# EAGLE schematic Schematic (EAGLE 9.7.0)
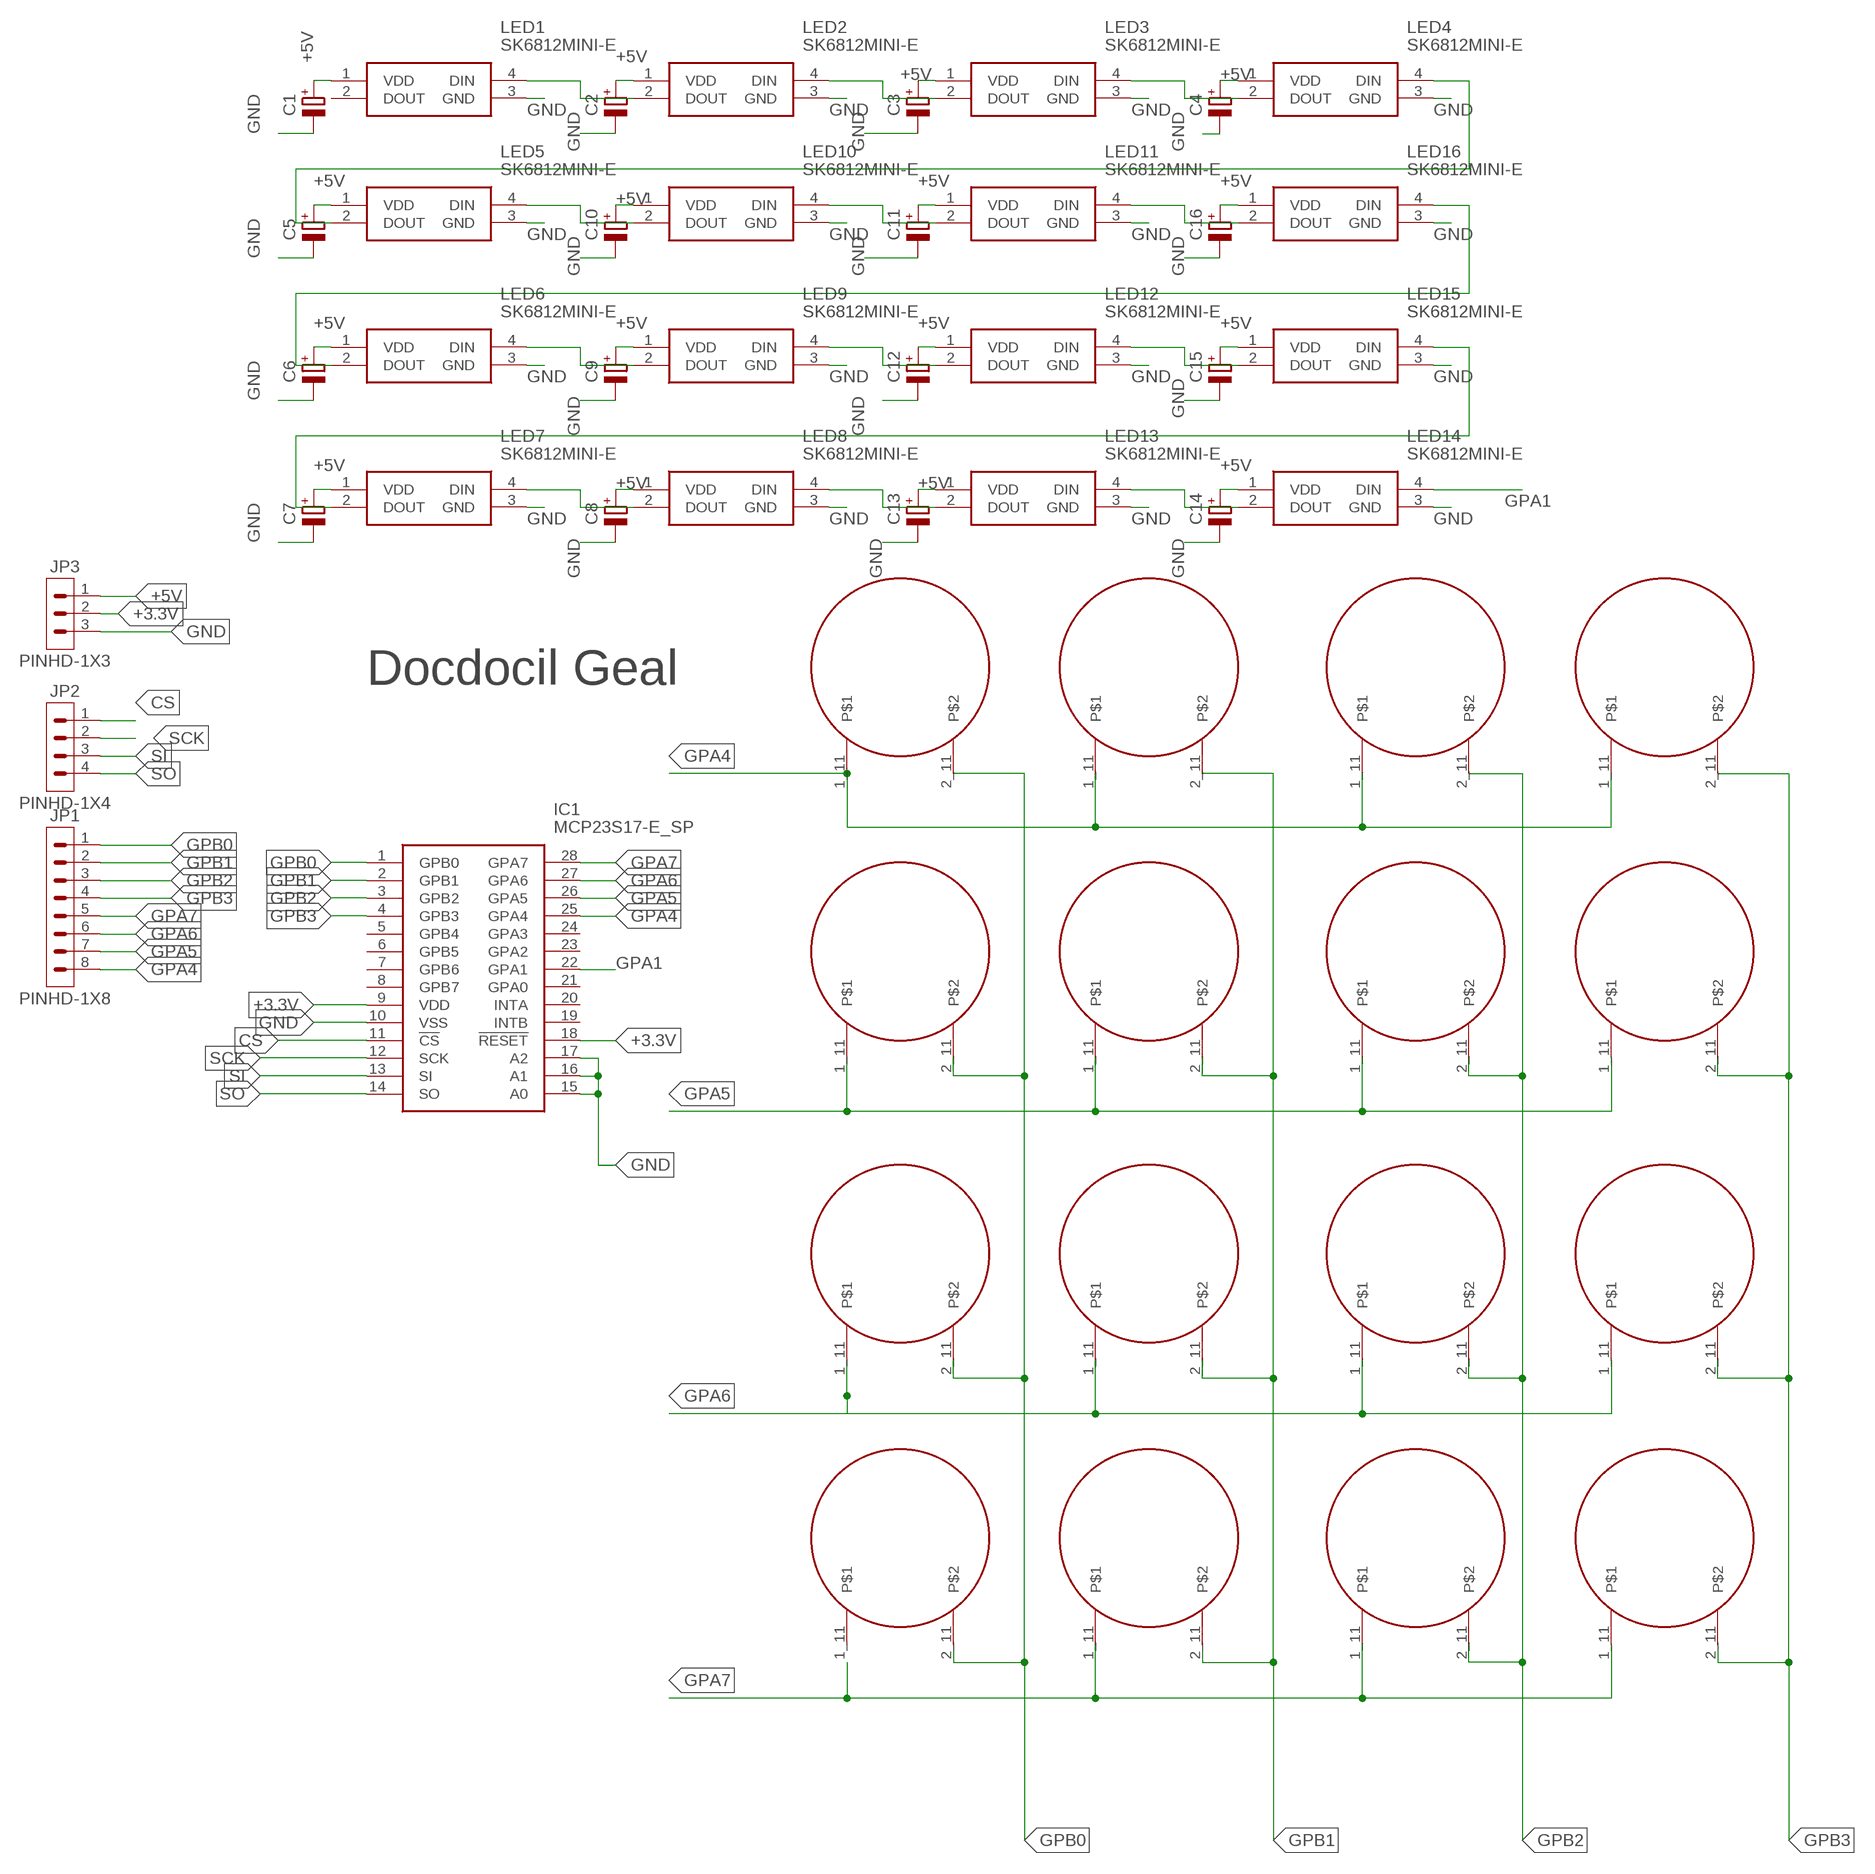
[diagram p0: schematic, sheet 1]

## Parts
C1  CAPACITOR-POLRADIAL-5MM-DIA  [CAPPRD254W65D500H1150B]
C2  CAPACITOR-POLRADIAL-5MM-DIA  [CAPPRD254W65D500H1150B]
C3  CAPACITOR-POLRADIAL-5MM-DIA  [CAPPRD254W65D500H1150B]
C4  CAPACITOR-POLRADIAL-5MM-DIA  [CAPPRD254W65D500H1150B]
C5  CAPACITOR-POLRADIAL-5MM-DIA  [CAPPRD254W65D500H1150B]
C6  CAPACITOR-POLRADIAL-5MM-DIA  [CAPPRD254W65D500H1150B]
C7  CAPACITOR-POLRADIAL-5MM-DIA  [CAPPRD254W65D500H1150B]
C8  CAPACITOR-POLRADIAL-5MM-DIA  [CAPPRD254W65D500H1150B]
C9  CAPACITOR-POLRADIAL-5MM-DIA  [CAPPRD254W65D500H1150B]
C10  CAPACITOR-POLRADIAL-5MM-DIA  [CAPPRD254W65D500H1150B]
C11  CAPACITOR-POLRADIAL-5MM-DIA  [CAPPRD254W65D500H1150B]
C12  CAPACITOR-POLRADIAL-5MM-DIA  [CAPPRD254W65D500H1150B]
C13  CAPACITOR-POLRADIAL-5MM-DIA  [CAPPRD254W65D500H1150B]
C14  CAPACITOR-POLRADIAL-5MM-DIA  [CAPPRD254W65D500H1150B]
C15  CAPACITOR-POLRADIAL-5MM-DIA  [CAPPRD254W65D500H1150B]
C16  CAPACITOR-POLRADIAL-5MM-DIA  [CAPPRD254W65D500H1150B]
IC1  MCP23S17-E_SP  [DIP794W56P254L3486H508Q28N]
JP1  PINHD-1X8  [1X08]
JP2  PINHD-1X4  [1X04]
JP3  PINHD-1X3  [1X03]
LED1  SK6812MINI-E  [SK6812MINIE]
LED2  SK6812MINI-E  [SK6812MINIE]
LED3  SK6812MINI-E  [SK6812MINIE]
LED4  SK6812MINI-E  [SK6812MINIE]
LED5  SK6812MINI-E  [SK6812MINIE]
LED6  SK6812MINI-E  [SK6812MINIE]
LED7  SK6812MINI-E  [SK6812MINIE]
LED8  SK6812MINI-E  [SK6812MINIE]
LED9  SK6812MINI-E  [SK6812MINIE]
LED10  SK6812MINI-E  [SK6812MINIE]
LED11  SK6812MINI-E  [SK6812MINIE]
LED12  SK6812MINI-E  [SK6812MINIE]
LED13  SK6812MINI-E  [SK6812MINIE]
LED14  SK6812MINI-E  [SK6812MINIE]
LED15  SK6812MINI-E  [SK6812MINIE]
LED16  SK6812MINI-E  [SK6812MINIE]
U$1  MIDI_B_RING  [RUBBER_RING_BUTTON]
U$2  MIDI_B_RING  [RUBBER_RING_BUTTON]
U$3  MIDI_B_RING  [RUBBER_RING_BUTTON]
U$4  MIDI_B_RING  [RUBBER_RING_BUTTON]
U$5  MIDI_B_RING  [RUBBER_RING_BUTTON]
U$6  MIDI_B_RING  [RUBBER_RING_BUTTON]
U$7  MIDI_B_RING  [RUBBER_RING_BUTTON]
U$8  MIDI_B_RING  [RUBBER_RING_BUTTON]
U$9  MIDI_B_RING  [RUBBER_RING_BUTTON]
U$10  MIDI_B_RING  [RUBBER_RING_BUTTON]
U$11  MIDI_B_RING  [RUBBER_RING_BUTTON]
U$12  MIDI_B_RING  [RUBBER_RING_BUTTON]
U$13  MIDI_B_RING  [RUBBER_RING_BUTTON]
U$14  MIDI_B_RING  [RUBBER_RING_BUTTON]
U$15  MIDI_B_RING  [RUBBER_RING_BUTTON]
U$16  MIDI_B_RING  [RUBBER_RING_BUTTON]

## Nets
+3.3V: IC1.9(VDD) IC1.18(!RESET) JP3.2
+5V: C1.1(+) C2.1(+) C3.1(+) C4.1(+) C5.1(+) C6.1(+) C7.1(+) C8.1(+) C9.1(+) C10.1(+) C11.1(+) C12.1(+) C13.1(+) C14.1(+) C15.1(+) C16.1(+) JP3.1 LED1.1(VDD) LED2.1(VDD) LED3.1(VDD) LED4.1(VDD) LED5.1(VDD) LED6.1(VDD) LED7.1(VDD) LED8.1(VDD) LED9.1(VDD) LED10.1(VDD) LED11.1(VDD) LED12.1(VDD) LED13.1(VDD) LED14.1(VDD) LED15.1(VDD) LED16.1(VDD)
CS: IC1.11(!CS) JP2.1
GND: C1.2(-) C2.2(-) C3.2(-) C4.2(-) C5.2(-) C6.2(-) C7.2(-) C8.2(-) C9.2(-) C10.2(-) C11.2(-) C12.2(-) C13.2(-) C14.2(-) C15.2(-) C16.2(-) IC1.10(VSS) IC1.15(A0) IC1.16(A1) IC1.17(A2) JP3.3 LED1.3(GND) LED2.3(GND) LED3.3(GND) LED4.3(GND) LED5.3(GND) LED6.3(GND) LED7.3(GND) LED8.3(GND) LED9.3(GND) LED10.3(GND) LED11.3(GND) LED12.3(GND) LED13.3(GND) LED14.3(GND) LED15.3(GND) LED16.3(GND)
GPA1: IC1.22(GPA1) LED14.4(DIN)
GPA4: IC1.25(GPA4) JP1.8 U$1.1_11 U$2.1_11 U$3.1_11 U$4.1_11
GPA5: IC1.26(GPA5) JP1.7 U$5.1_11 U$6.1_11 U$7.1_11 U$8.1_11
GPA6: IC1.27(GPA6) JP1.6 U$9.1_11 U$10.1_11 U$11.1_11 U$12.1_11
GPA7: IC1.28(GPA7) JP1.5 U$13.1_11 U$14.1_11 U$15.1_11
GPB0: IC1.1(GPB0) JP1.1 U$1.2_11 U$8.2_11 U$9.2_11 U$16.2_11
GPB1: IC1.2(GPB1) JP1.2 U$2.2_11 U$7.2_11 U$10.2_11 U$15.2_11
GPB2: IC1.3(GPB2) JP1.3 U$3.2_11 U$6.2_11 U$11.2_11 U$14.2_11
GPB3: IC1.4(GPB3) JP1.4 U$4.2_11 U$5.2_11 U$12.2_11 U$13.2_11
N$1: LED1.4(DIN) LED2.2(DOUT)
N$2: LED2.4(DIN) LED3.2(DOUT)
N$3: LED3.4(DIN) LED4.2(DOUT)
N$4: LED5.4(DIN) LED10.2(DOUT)
N$5: LED10.4(DIN) LED11.2(DOUT)
N$6: LED11.4(DIN) LED16.2(DOUT)
N$7: LED6.4(DIN) LED9.2(DOUT)
N$8: LED9.4(DIN) LED12.2(DOUT)
N$9: LED12.4(DIN) LED15.2(DOUT)
N$10: LED7.4(DIN) LED8.2(DOUT)
N$11: LED8.4(DIN) LED13.2(DOUT)
N$12: LED13.4(DIN) LED14.2(DOUT)
N$13: LED7.2(DOUT) LED15.4(DIN)
N$14: LED6.2(DOUT) LED16.4(DIN)
N$15: LED4.4(DIN) LED5.2(DOUT)
SCK: IC1.12(SCK) JP2.2
SI: IC1.13(SI) JP2.3
SO: IC1.14(SO) JP2.4
Unconnected: IC1.5(GPB4) IC1.6(GPB5) IC1.7(GPB6) IC1.8(GPB7) IC1.19(INTB) IC1.20(INTA) IC1.21(GPA0) IC1.23(GPA2) IC1.24(GPA3) LED1.2(DOUT) U$16.1_11

## Notes on the sheet
- Docdocil Geal

## Library data of the parts
C1-C16 = Tinkercad:CAPACITOR-POL: Capacitor Polarised - Generic
IC1 = MCP23S17-E_SP:MCP23S17-E_SP: Microchip MCP23S17-E/SO, 16-channel 16bit I/O Expander 5MHz, Serial-SPI, 28-Pin SOIC Source: Datasheet <https://datasheet.datasheetarchive.com/originals/distributors/SFDatasheet-4/sf-00090057.pdf>
JP1 = Connector:PINHD-1X8: Pin Header
JP2 = Connector:PINHD-1X4: Pin Header
JP3 = Connector:PINHD-1X3: Pin Header
LED1-LED16 = SK6812MINI-E:SK6812MINI-E: 3.2x2.8x1.78 mm 0.2W Intelligent external control surface mount SMD LED (MSL:5a) Source: Datasheet <http://yushakobo.jp/ds/YS-SK6812MINI-E.pdf>
U$1-U$16 = rubber_ring_button(F):MIDI_B_RING